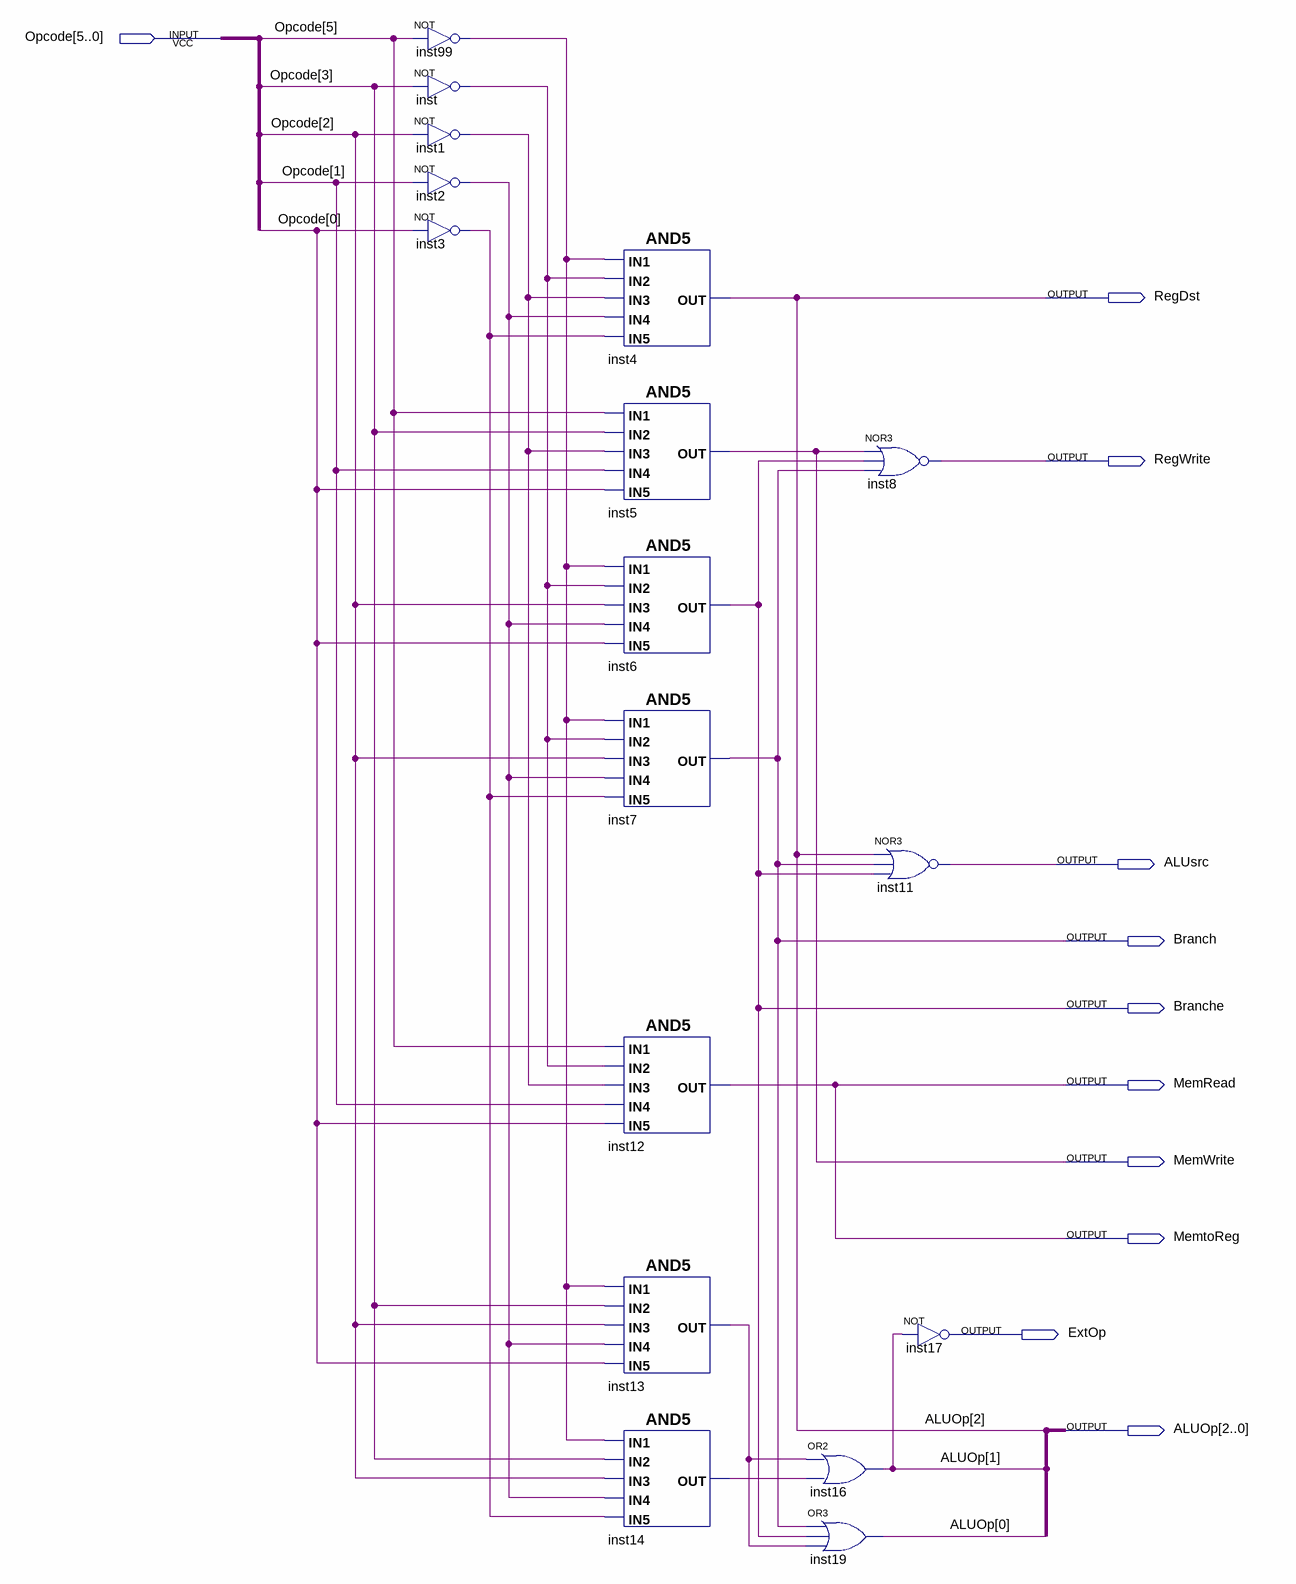
[diagram p0: schematic sheet]
// Quartus schematic ControlUnit.bdf as structural Verilog: 17 symbols, 11 pins
module ControlUnit (
  input  [5:0] Opcode,
  output RegDst,
  output RegWrite,
  output ALUsrc,
  output Branch,
  output Branche,
  output MemRead,
  output MemWrite,
  output MemtoReg,
  output ExtOp,
  output [2:0] ALUOp
);

  wire inst1_out, inst2_out, inst3_out, inst13_out, inst14_out, inst99_out, inst_out;

  not inst99 (inst99_out, Opcode[5]);
  not inst (inst_out, Opcode[3]);
  not inst1 (inst1_out, Opcode[2]);
  not inst2 (inst2_out, Opcode[1]);
  not inst3 (inst3_out, Opcode[0]);
  and inst4 (ALUOp[2], inst99_out, inst_out, inst1_out, inst2_out, inst3_out);
  and inst5 (MemWrite, Opcode[5], Opcode[3], inst1_out, Opcode[1], Opcode[0]);
  and inst6 (Branche, inst99_out, inst_out, Opcode[2], inst2_out, Opcode[0]);
  and inst7 (Branch, inst99_out, inst_out, Opcode[2], inst2_out, inst3_out);
  and inst12 (MemRead, Opcode[5], inst_out, inst1_out, Opcode[1], Opcode[0]);
  and inst13 (inst13_out, inst99_out, Opcode[3], Opcode[2], inst2_out, Opcode[0]);
  and inst14 (inst14_out, inst99_out, Opcode[3], Opcode[2], inst2_out, inst3_out);
  or inst16 (ALUOp[1], inst13_out, inst14_out);
  or inst19 (ALUOp[0], Branch, Branche, inst13_out);
  nor inst8 (RegWrite, MemWrite, Branche, Branch);
  nor inst11 (ALUsrc, ALUOp[2], Branch, Branche);
  not inst17 (ExtOp, ALUOp[1]);

  assign MemtoReg = MemRead;
  assign RegDst = ALUOp[2];
endmodule
